# Altium project PART7 - ESP32 PICO.PrjPcb
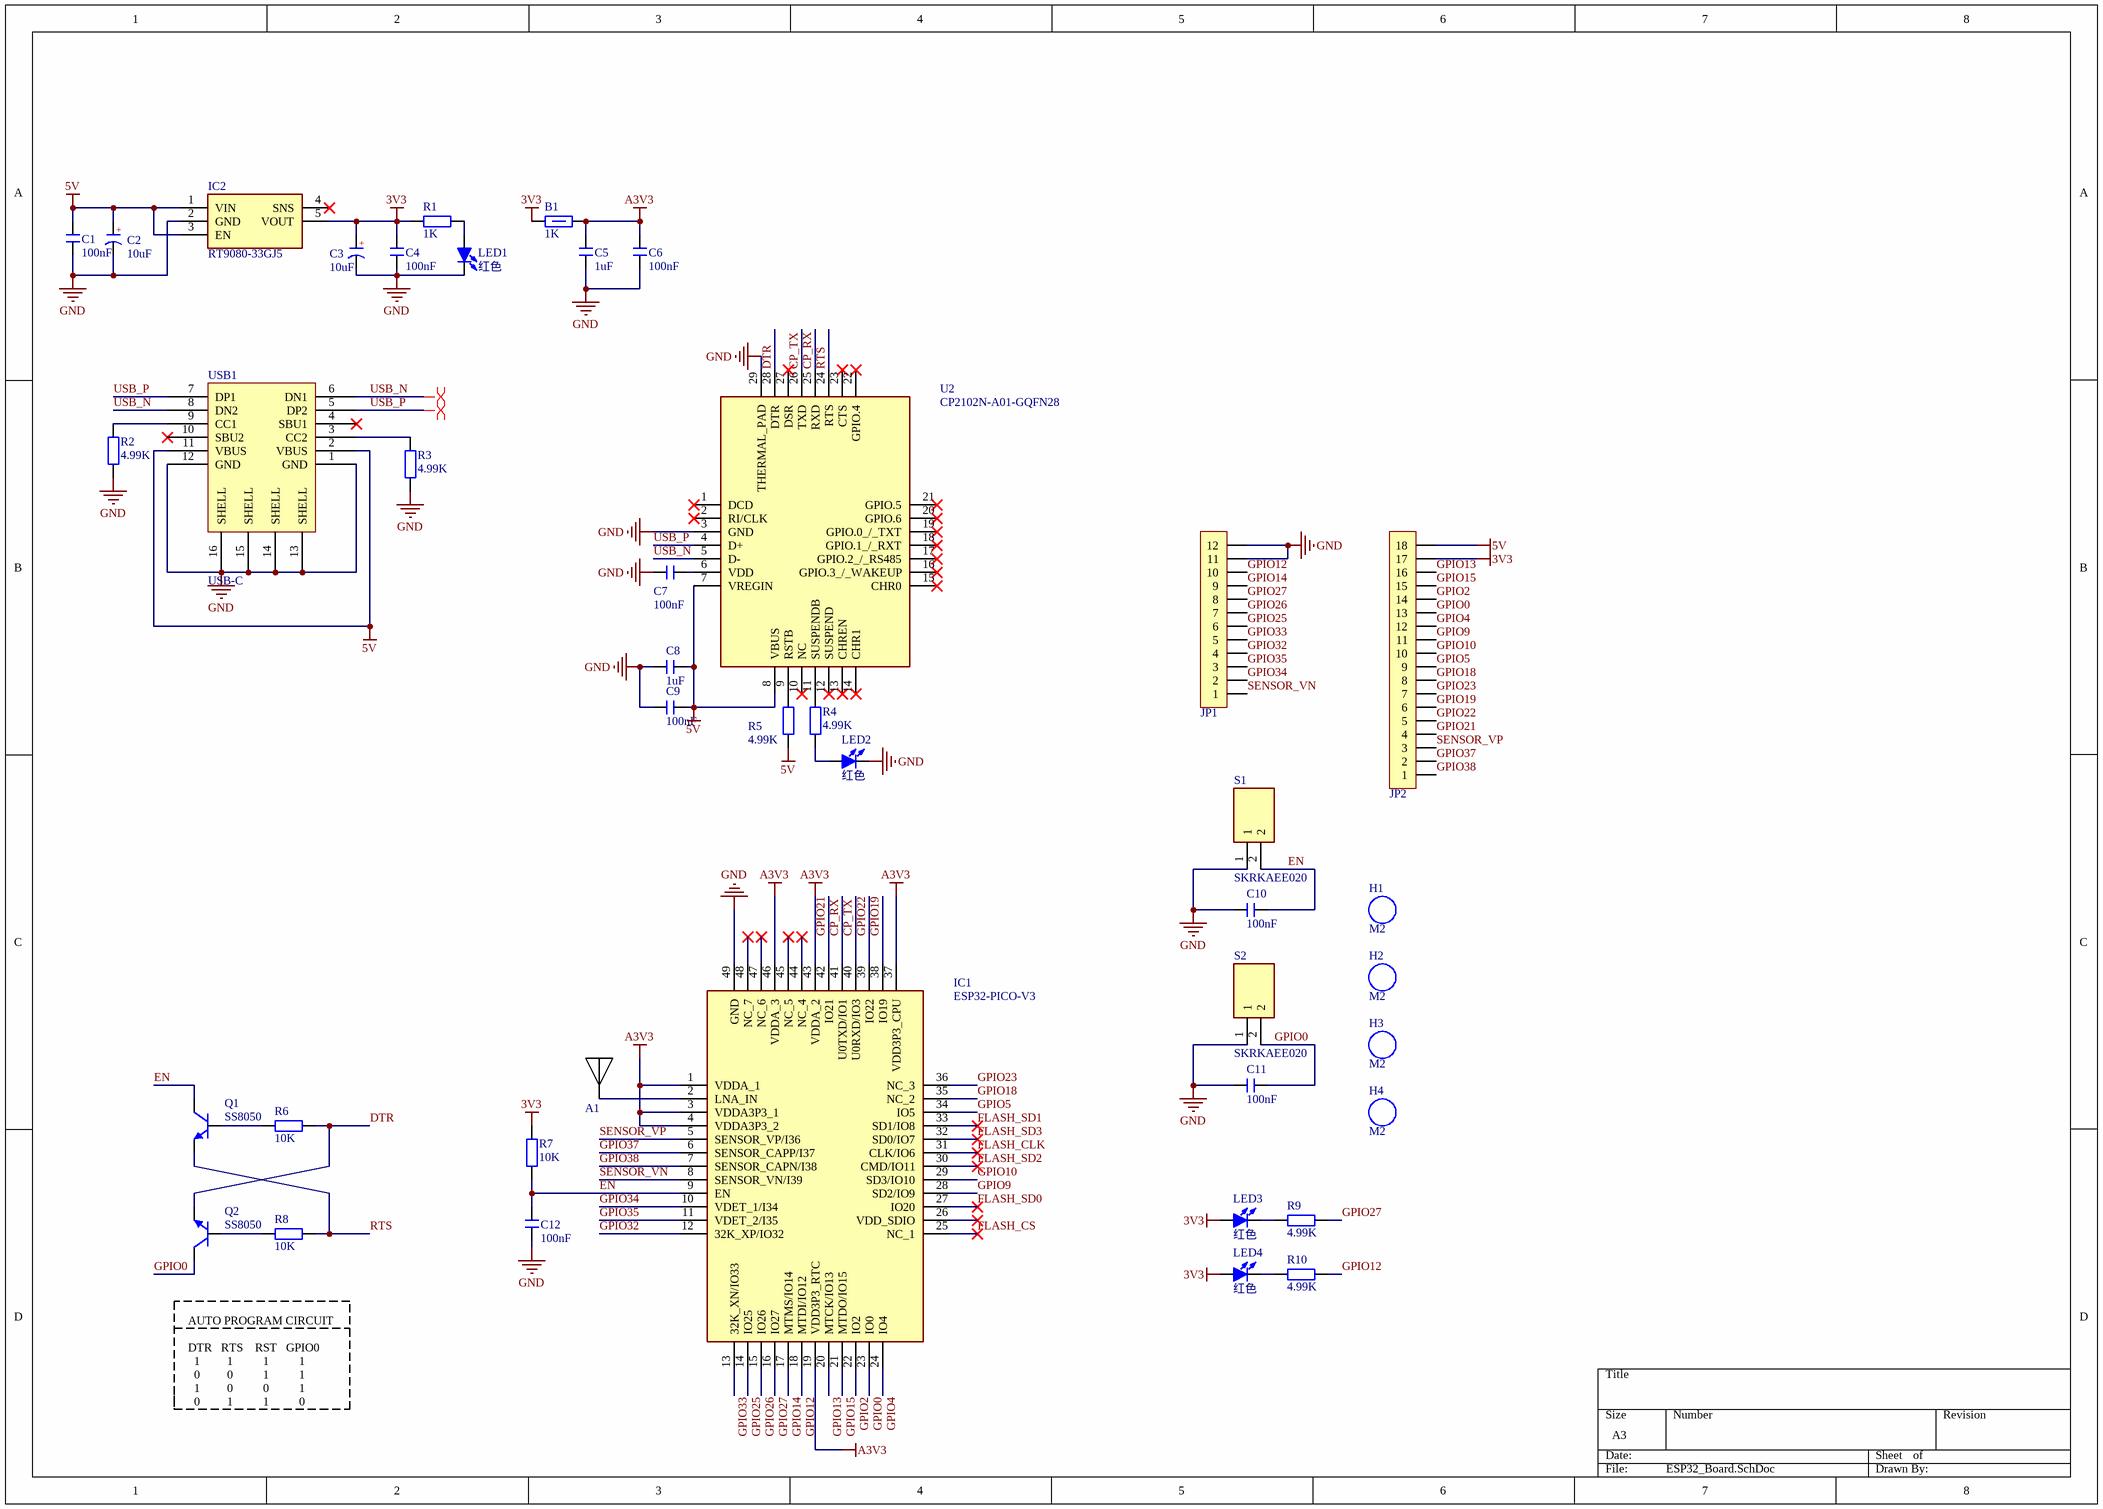
[diagram p0: ESP32_Board.SchDoc]
1 sheet, 42 parts. Net scope: global (net labels, ports and power ports of the same name join across sheets).
Board file: ESP32_Board.PcbDoc

## Sheet ESP32_Board.SchDoc
size A3; SheetNumber: 1; SheetTotal: 1

### Parts
A1  RAINSUN  [ANT-Rainsun-AN5120]  (value not drawn)
B1  1K  [B 0603_L]
C1  100nF  [C 0603_L]
C2  10uF  [CD A(3216)]
C3  10uF  [CD A(3216)]
C4  100nF  [C 0603_L]
C5  1uF  [C 0603_L]
C6  100nF  [C 0603_L]
C7  100nF  [C 0603_L]
C8  1uF  [C 0603_L]
C9  100nF  [C 0603_L]
C10  100nF  [C 0603_L]
C11  100nF  [C 0603_L]
C12  100nF  [C 0603_L]
H1  M2  [M2 - 2.175]
H2  M2  [M2 - 2.175]
H3  M2  [M2 - 2.175]
H4  M2  [M2 - 2.175]
IC1  ESP32-PICO-V3  [ESP32PICOV3]
IC2  RT9080-33GJ5  [SOT94P280X100-5N]
JP1  HDR-1X12  [HDR2.54-LI-12P]  (value not drawn)
JP2  HDR-1X18  [HDR2.54-LI-18P]  (value not drawn)
LED1  红色  [LED 0603B]
LED2  红色  [LED 0603B]
LED3  红色  [LED 0603W]
LED4  红色  [LED 0603W]
Q1  SS8050  [SOT23-3N]
Q2  SS8050  [SOT23-3N]
R1  1K  [R 0603_L]
R2  4.99K  [R 0603_L]
R3  4.99K  [R 0603_L]
R4  4.99K  [R 0603_L]
R5  4.99K  [R 0603_L]
R6  10K  [R 0603_L]
R7  10K  [R 0603_L]
R8  10K  [R 0603_L]
R9  4.99K  [R 0603_L]
R10  4.99K  [R 0603_L]
S1  SKRKAEE020  [SKRKAEE020]
S2  SKRKAEE020  [SKRKAEE020]
U2  CP2102N-A01-GQFN28  [QFN28]
USB1  USB-C  [USB-C-16]

### Nets
3V3: B1.2 C3.1(A) C4.2 IC2.5(VOUT) JP2.17 LED3.1(A) LED4.1(A) R1.2 R7.1
5V: C1.2 C2.1(A) C8.1 C9.1 IC2.1(VIN) IC2.3(EN) JP2.18 R5.1 U2.7(VREGIN) U2.8(VBUS) USB1.2(VBUS) USB1.11(VBUS)
A3V3: B1.1 C5.2 C6.2 IC1.1(VDDA_1) IC1.3(VDDA3P3_1) IC1.4(VDDA3P3_2) IC1.19(VDD3P3_RTC) IC1.37(VDD3P3_CPU) IC1.43(VDDA_2) IC1.46(VDDA_3)
GND: C1.1 C2.2(K) C3.2(K) C4.1 C5.1 C6.1 C7.2 C8.2 C9.2 C10.2 C11.2 C12.1 IC1.49(GND) IC2.2(GND) JP1.11 JP1.12 LED1.2(K) LED2.2(K) R2.2 R3.2 S1.1 S2.1 U2.3(GND) U2.29(THERMAL_PAD) USB1.1(GND) USB1.12(GND) USB1.13(SHELL) USB1.14(SHELL) USB1.15(SHELL) USB1.16(SHELL)
CP_RX: IC1.41(U0TXD/IO1) U2.25(RXD)
CP_TX: IC1.40(U0RXD/IO3) U2.26(TXD)
DTR: Q2.2(E) R6.1 U2.28(DTR)
EN: C10.1 C12.2 IC1.9(EN) Q1.3(C) R7.2 S1.2
FLASH_CLK: IC1.31(CLK/IO6)
FLASH_CS: IC1.25(NC_1)
FLASH_SD0: IC1.27(IO20)
FLASH_SD1: IC1.33(SD1/IO8)
FLASH_SD2: IC1.30(CMD/IO11)
FLASH_SD3: IC1.32(SD0/IO7)
GPIO0: C11.1 IC1.23(IO0) JP2.13 Q2.3(C) S2.2
GPIO2: IC1.22(IO2) JP2.14
GPIO4: IC1.24(IO4) JP2.12
GPIO5: IC1.34(IO5) JP2.9
GPIO9: IC1.28(SD2/IO9) JP2.11
GPIO10: IC1.29(SD3/IO10) JP2.10
GPIO12: IC1.18(MTDI/IO12) JP1.10 R10.1
GPIO13: IC1.20(MTCK/IO13) JP2.16
GPIO14: IC1.17(MTMS/IO14) JP1.9
GPIO15: IC1.21(MTDO/IO15) JP2.15
GPIO18: IC1.35(NC_2) JP2.8
GPIO19: IC1.38(IO19) JP2.6
GPIO21: IC1.42(IO21) JP2.4
GPIO22: IC1.39(IO22) JP2.5
GPIO23: IC1.36(NC_3) JP2.7
GPIO25: IC1.14(IO25) JP1.6
GPIO26: IC1.15(IO26) JP1.7
GPIO27: IC1.16(IO27) JP1.8 R9.1
GPIO32: IC1.12(32K_XP/IO32) JP1.4
GPIO33: IC1.13(32K_XN/IO33) JP1.5
GPIO34: IC1.10(VDET_1/I34) JP1.2
GPIO35: IC1.11(VDET_2/I35) JP1.3
GPIO37: IC1.6(SENSOR_CAPP/I37) JP2.2
GPIO38: IC1.7(SENSOR_CAPN/I38) JP2.1
RTS: Q1.2(E) R8.1 U2.24(RTS)
SENSOR_VN: IC1.8(SENSOR_VN/I39) JP1.1
SENSOR_VP: IC1.5(SENSOR_VP/I36) JP2.3
USB_N: U2.5(D-) USB1.6(DN1) USB1.8(DN2)
USB_P: U2.4(D+) USB1.5(DP2) USB1.7(DP1)
NetA1_1: A1.1 IC1.2(LNA_IN)
NetC7_1: C7.1 U2.6(VDD)
NetLED1_1: LED1.1(A) R1.1
NetLED2_1: LED2.1(A) R4.1
NetLED3_2: LED3.2(K) R9.2
NetLED4_2: LED4.2(K) R10.2
NetQ1_1: Q1.1(B) R6.2
NetQ2_1: Q2.1(B) R8.2
NetR2_1: R2.1 USB1.9(CC1)
NetR3_1: R3.1 USB1.3(CC2)
NetR4_2: R4.2 U2.11(SUSPENDB)
NetR5_2: R5.2 U2.9(RSTB)

Not connected (* = marked no-connect by the designer): IC1 26(VDD_SDIO)* 44(NC_4)* 45(NC_5)* 47(NC_6)* 48(NC_7)*; IC2 4(SNS)*; U2 1(DCD)* 2(RI/CLK)* 10(NC)* 12(SUSPEND)* 13(CHREN)* 14(CHR1)* 15(CHR0)* 16(GPIO.3_/_WAKEUP)* 17(GPIO.2_/_RS485)* 18(GPIO.1_/_RXT)* 19(GPIO.0_/_TXT)* 20(GPIO.6)* 21(GPIO.5)* 22(GPIO.4)* 23(CTS)* 27(DSR)*; USB1 4(SBU1)* 10(SBU2)*

### Layout directives
differential pair: USB_N, USB_P

### Notes on the sheet
- AUTO PROGRAM CIRCUIT
  DTR   RTS    RST   GPIO0
  1         1          1          1
  0         0          1          1
  1         0          0          1
  0         1          1          0
- (in symbol C-CD) +

### Library data of the parts
A1 = ANT-Rainsun-AP5120: 陶瓷天线
B1 = B: 贴片磁珠
C1 C4-C12 = C: 无极性贴片电容; 版权归属: 源创客; BOM名称: 无极性贴片电容; 学习资源: www.ooocke.com
C2 C3 = C-CD: 贴片钽电容; 版权归属: 源创客; BOM名称: 贴片钽电容; 学习资源: www.ooocke.com
H1-H4 = M2: 铜柱孔; 版权归属: 源创客; BOM名称: 铜柱孔; 学习资源: www.ooocke.com
IC1 = ESP32-PICO-V3: Integrated Circuit; Manufacturer_Name: Espressif Systems; Datasheet Link: https://kr.mouser.com/datasheet/2/891/esp32-pico-v3_datasheet_en-1842685.pdf; Height: 1.04mm; Manufacturer_Part_Number: ESP32-PICO-V3; Mouser Part Number: 356-ESP32-PICO-V3; Mouser Price/Stock: https://www.mouser.co.uk/ProductDetail/Espressif-Systems/ESP32-PICO-V3?qs=GBLSl2Akirs311o8knsnZA%3D%3D
IC2 = RT9080-33GJ5: Integrated Circuit; Manufacturer_Name: RICHTEK; Datasheet Link: https://www.richtek.com/assets/product_file/RT9080/DS9080-05.pdf; Height: 1mm; Manufacturer_Part_Number: RT9080-33GJ5
JP1 = Header 12: 12P接插件; 版权归属: 源创客; BOM名称: 12P接插件; 学习资源: www.ooocke.com
JP2 = Header 18: 18P接插件; 版权归属: 源创客; BOM名称: 18P接插件; 学习资源: www.ooocke.com
LED1-LED4 = LED-SMD: 贴片LED; 版权归属: 源创客; BOM名称: 贴片LED; 学习资源: www.ooocke.com
Q1 Q2 = 8050-SMD: 高频放大-NPN型; 版权归属: 源创客; 属性: 40V 1.5A 1W 100MHZ; BOM名称: 高频放大-NPN型; 学习资源: www.ooocke.com
R1-R10 = R: 贴片电阻; 版权归属: 源创客; BOM名称: 贴片电阻; 学习资源: www.ooocke.com
S1 S2 = SKRKAEE020: Switch; Manufacturer_Name: ALPS Electric; Datasheet Link: http://www.alps.com/prod/info/J/HTML/Tact/SurfaceMount/SKRK/SKRKAEE020.html; Height: 2mm; Manufacturer_Part_Number: SKRKAEE020; Mouser Part Number: 688-SKRKAEE020; Mouser Price/Stock: https://www.mouser.co.uk/ProductDetail/Alps-Alpine/SKRKAEE020?qs=MrosSN5%252BUQW89XjXIp8Ugw%3D%3D
U2 = CP2102N-A01-GQFN28: Integrated Circuit; Manufacturer_Name: Silicon Labs; Datasheet Link: http://www.farnell.com/datasheets/2245279.pdf; Height: 0.8mm; Manufacturer_Part_Number: CP2102N-A01-GQFN28; Mouser Part Number: 634-CP2102NA01GQFN28; Mouser Price/Stock: https://www.mouser.co.uk/ProductDetail/Silicon-Labs/CP2102N-A01-GQFN28?qs=%252BaFUgn%2FzHmxGRIXZFn%252Btdg%3D%3D; Arrow Part Number: CP2102N-A01-GQFN28; Arrow Price/Stock: https://www.arrow.com/en/products/cp2102n-a01-gqfn28/silicon-labs
USB1 = USB-C/16P: USB-C型母接口; 版权归属: 源创客; BOM名称: USB-C型母接口; 学习资源: www.ooocke.com